# Altium schematic sheet S7CAS-PLEIADES-CARTE-MERE_P07_FPGA_MISC.SchDoc
size Tabloid; DocumentNumber: 9; SheetNumber: 9; SheetTotal: 16; Sheet_Name: FPGA_MISC; Size: 11x17
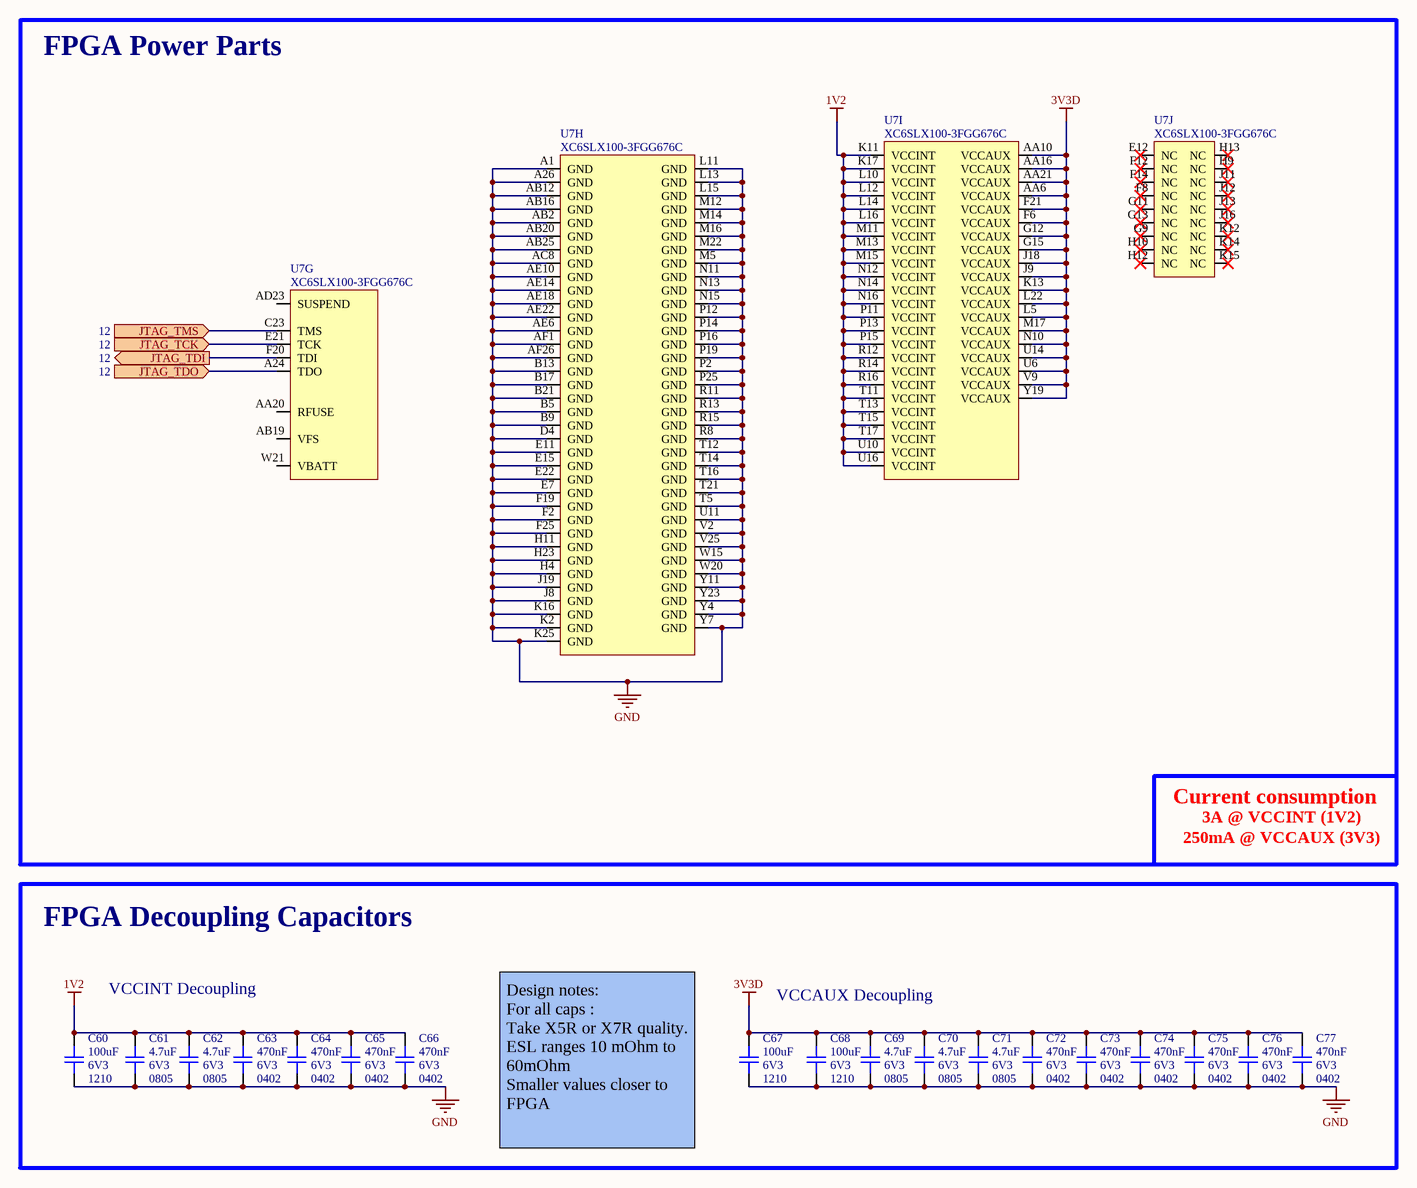
[diagram p0: S7CAS-PLEIADES-CARTE-MERE_P07_FPGA_MISC.SchDoc]

## Parts
C60  value 100uF  Voltage: 6V3  Package: 1210  [CAP_1210]  (hidden comment: CAP - 1210)
C61  value 4.7uF  Voltage: 6V3  Package: 0805  [CAP_0805]  (hidden comment: CAP - 0805)
C62  value 4.7uF  Voltage: 6V3  Package: 0805  [CAP_0805]  (hidden comment: CAP - 0805)
C63  value 470nF  Voltage: 6V3  Package: 0402  [CAP_0402]  (hidden comment: CAP - 0402)
C64  value 470nF  Voltage: 6V3  Package: 0402  [CAP_0402]  (hidden comment: CAP - 0402)
C65  value 470nF  Voltage: 6V3  Package: 0402  [CAP_0402]  (hidden comment: CAP - 0402)
C66  value 470nF  Voltage: 6V3  Package: 0402  [CAP_0402]  (hidden comment: CAP - 0402)
C67  value 100uF  Voltage: 6V3  Package: 1210  [CAP_1210]  (hidden comment: CAP - 1210)
C68  value 100uF  Voltage: 6V3  Package: 1210  [CAP_1210]  (hidden comment: CAP - 1210)
C69  value 4.7uF  Voltage: 6V3  Package: 0805  [CAP_0805]  (hidden comment: CAP - 0805)
C70  value 4.7uF  Voltage: 6V3  Package: 0805  [CAP_0805]  (hidden comment: CAP - 0805)
C71  value 4.7uF  Voltage: 6V3  Package: 0805  [CAP_0805]  (hidden comment: CAP - 0805)
C72  value 470nF  Voltage: 6V3  Package: 0402  [CAP_0402]  (hidden comment: CAP - 0402)
C73  value 470nF  Voltage: 6V3  Package: 0402  [CAP_0402]  (hidden comment: CAP - 0402)
C74  value 470nF  Voltage: 6V3  Package: 0402  [CAP_0402]  (hidden comment: CAP - 0402)
C75  value 470nF  Voltage: 6V3  Package: 0402  [CAP_0402]  (hidden comment: CAP - 0402)
C76  value 470nF  Voltage: 6V3  Package: 0402  [CAP_0402]  (hidden comment: CAP - 0402)
C77  value 470nF  Voltage: 6V3  Package: 0402  [CAP_0402]  (hidden comment: CAP - 0402)
U7  XC6SLX100-3FGG676C  [FPGA_XILINX_FGG676]  (parts G,H,I,J of 10)

## Blocks framed on the sheet
FPGA Power Parts: U7
FPGA Decoupling Capacitors: C60-C77

## Ports
JTAG_TCK (in, see 12), JTAG_TDI (out, see 12), JTAG_TDO (in, see 12), JTAG_TMS (in, see 12)

## Nets
1V2: C60.2 C61.2 C62.2 C63.2 C64.2 C65.2 C66.2 U7.K11(VCCINT) U7.K17(VCCINT) U7.L10(VCCINT) U7.L12(VCCINT) U7.L14(VCCINT) U7.L16(VCCINT) U7.M11(VCCINT) U7.M13(VCCINT) U7.M15(VCCINT) U7.N12(VCCINT) U7.N14(VCCINT) U7.N16(VCCINT) U7.P11(VCCINT) U7.P13(VCCINT) U7.P15(VCCINT) U7.R12(VCCINT) U7.R14(VCCINT) U7.R16(VCCINT) U7.T11(VCCINT) U7.T13(VCCINT) U7.T15(VCCINT) U7.T17(VCCINT) U7.U10(VCCINT) U7.U16(VCCINT)
3V3D: C67.2 C68.2 C69.2 C70.2 C71.2 C72.2 C73.2 C74.2 C75.2 C76.2 C77.2 U7.AA6(VCCAUX) U7.AA10(VCCAUX) U7.AA16(VCCAUX) U7.AA21(VCCAUX) U7.F6(VCCAUX) U7.F21(VCCAUX) U7.G12(VCCAUX) U7.G15(VCCAUX) U7.J9(VCCAUX) U7.J18(VCCAUX) U7.K13(VCCAUX) U7.L5(VCCAUX) U7.L22(VCCAUX) U7.M17(VCCAUX) U7.N10(VCCAUX) U7.U6(VCCAUX) U7.U14(VCCAUX) U7.V9(VCCAUX) U7.Y19(VCCAUX)
GND: C60.1 C61.1 C62.1 C63.1 C64.1 C65.1 C66.1 C67.1 C68.1 C69.1 C70.1 C71.1 C72.1 C73.1 C74.1 C75.1 C76.1 C77.1 U7.A1(GND) U7.A26(GND) U7.AB2(GND) U7.AB12(GND) U7.AB16(GND) U7.AB20(GND) U7.AB25(GND) U7.AC8(GND) U7.AE6(GND) U7.AE10(GND) U7.AE14(GND) U7.AE18(GND) U7.AE22(GND) U7.AF1(GND) U7.AF26(GND) U7.B5(GND) U7.B9(GND) U7.B13(GND) U7.B17(GND) U7.B21(GND) U7.D4(GND) U7.E7(GND) U7.E11(GND) U7.E15(GND) U7.E22(GND) U7.F2(GND) U7.F19(GND) U7.F25(GND) U7.H4(GND) U7.H11(GND) U7.H23(GND) U7.J8(GND) U7.J19(GND) U7.K2(GND) U7.K16(GND) U7.K25(GND) U7.L11(GND) U7.L13(GND) U7.L15(GND) U7.M5(GND) U7.M12(GND) U7.M14(GND) U7.M16(GND) U7.M22(GND) U7.N11(GND) U7.N13(GND) U7.N15(GND) U7.P2(GND) U7.P12(GND) U7.P14(GND) U7.P16(GND) U7.P19(GND) U7.P25(GND) U7.R8(GND) U7.R11(GND) U7.R13(GND) U7.R15(GND) U7.T5(GND) U7.T12(GND) U7.T14(GND) U7.T16(GND) U7.T21(GND) U7.U11(GND) U7.V2(GND) U7.V25(GND) U7.W15(GND) U7.W20(GND) U7.Y4(GND) U7.Y7(GND) U7.Y11(GND) U7.Y23(GND)
JTAG_TCK: U7.E21(TCK) ; port JTAG_TCK
JTAG_TDI: U7.F20(TDI) ; port JTAG_TDI
JTAG_TDO: U7.A24(TDO) ; port JTAG_TDO
JTAG_TMS: U7.C23(TMS) ; port JTAG_TMS

Not connected (* = marked no-connect by the designer): U7 AA20(RFUSE) AB19(VFS) AD23(SUSPEND) E12(NC)* F8(NC)* F12(NC)* F14(NC)* G9(NC)* G11(NC)* G13(NC)* H9(NC)* H10(NC)* H12(NC)* H13(NC)* J11(NC)* J12(NC)* J13(NC)* J16(NC)* K12(NC)* K14(NC)* K15(NC)* W21(VBATT)

## Notes on the sheet
- Current consumption
- 3A @ VCCINT (1V2)
- 250mA @ VCCAUX (3V3)
- VCCINT Decoupling
- VCCAUX Decoupling
- Design notes:
  For all caps :
  Take X5R or X7R quality.
  ESL ranges 10 mOhm to 60mOhm
  Smaller values closer to FPGA
- Sheet Name
- Project Title
- Global Project
- Size
- Group
- Revision
- Date
- Sheet
- of
- Filename
- Designers

## Library data of the parts
C60 C67 C68 = CAP - 1210: Precision: 10%; Current: *; CreatedBy: Jonathan Bouchard; Power: *
C61 C62 C69-C71 = CAP - 0805: Precision: 10%; Current: *; CreatedBy: Jonathan Bouchard; Power: *
C63-C66 C72-C77 = CAP - 0402: Precision: 10%; Current: *; CreatedBy: Jonathan Bouchard; Power: *
U7 = FPGA_XC6SLX100-3FGG676C: FPGA - XILINX SPARTAN 6 480 I/O - BGA-676; Voltage: 1.14 V ~ 1.26 V; Current: *; Power: *; Mfg: Xilinx; Mfg Part Number: XC6SLX100-3FGG676C; HelpURL: https://www.xilinx.com/support/documentation/data_sheets/ds162.pdf; CreatedBy: Jonathan Bouchard; Temperature: 0°C ~ 85°C (TJ); Value: *; Precision: *; Package: BGA-676; Supplier 1: Digikey; Supplier Part Number 1: 122-1760-ND